# Altium schematic sheet main.SchDoc
size A3
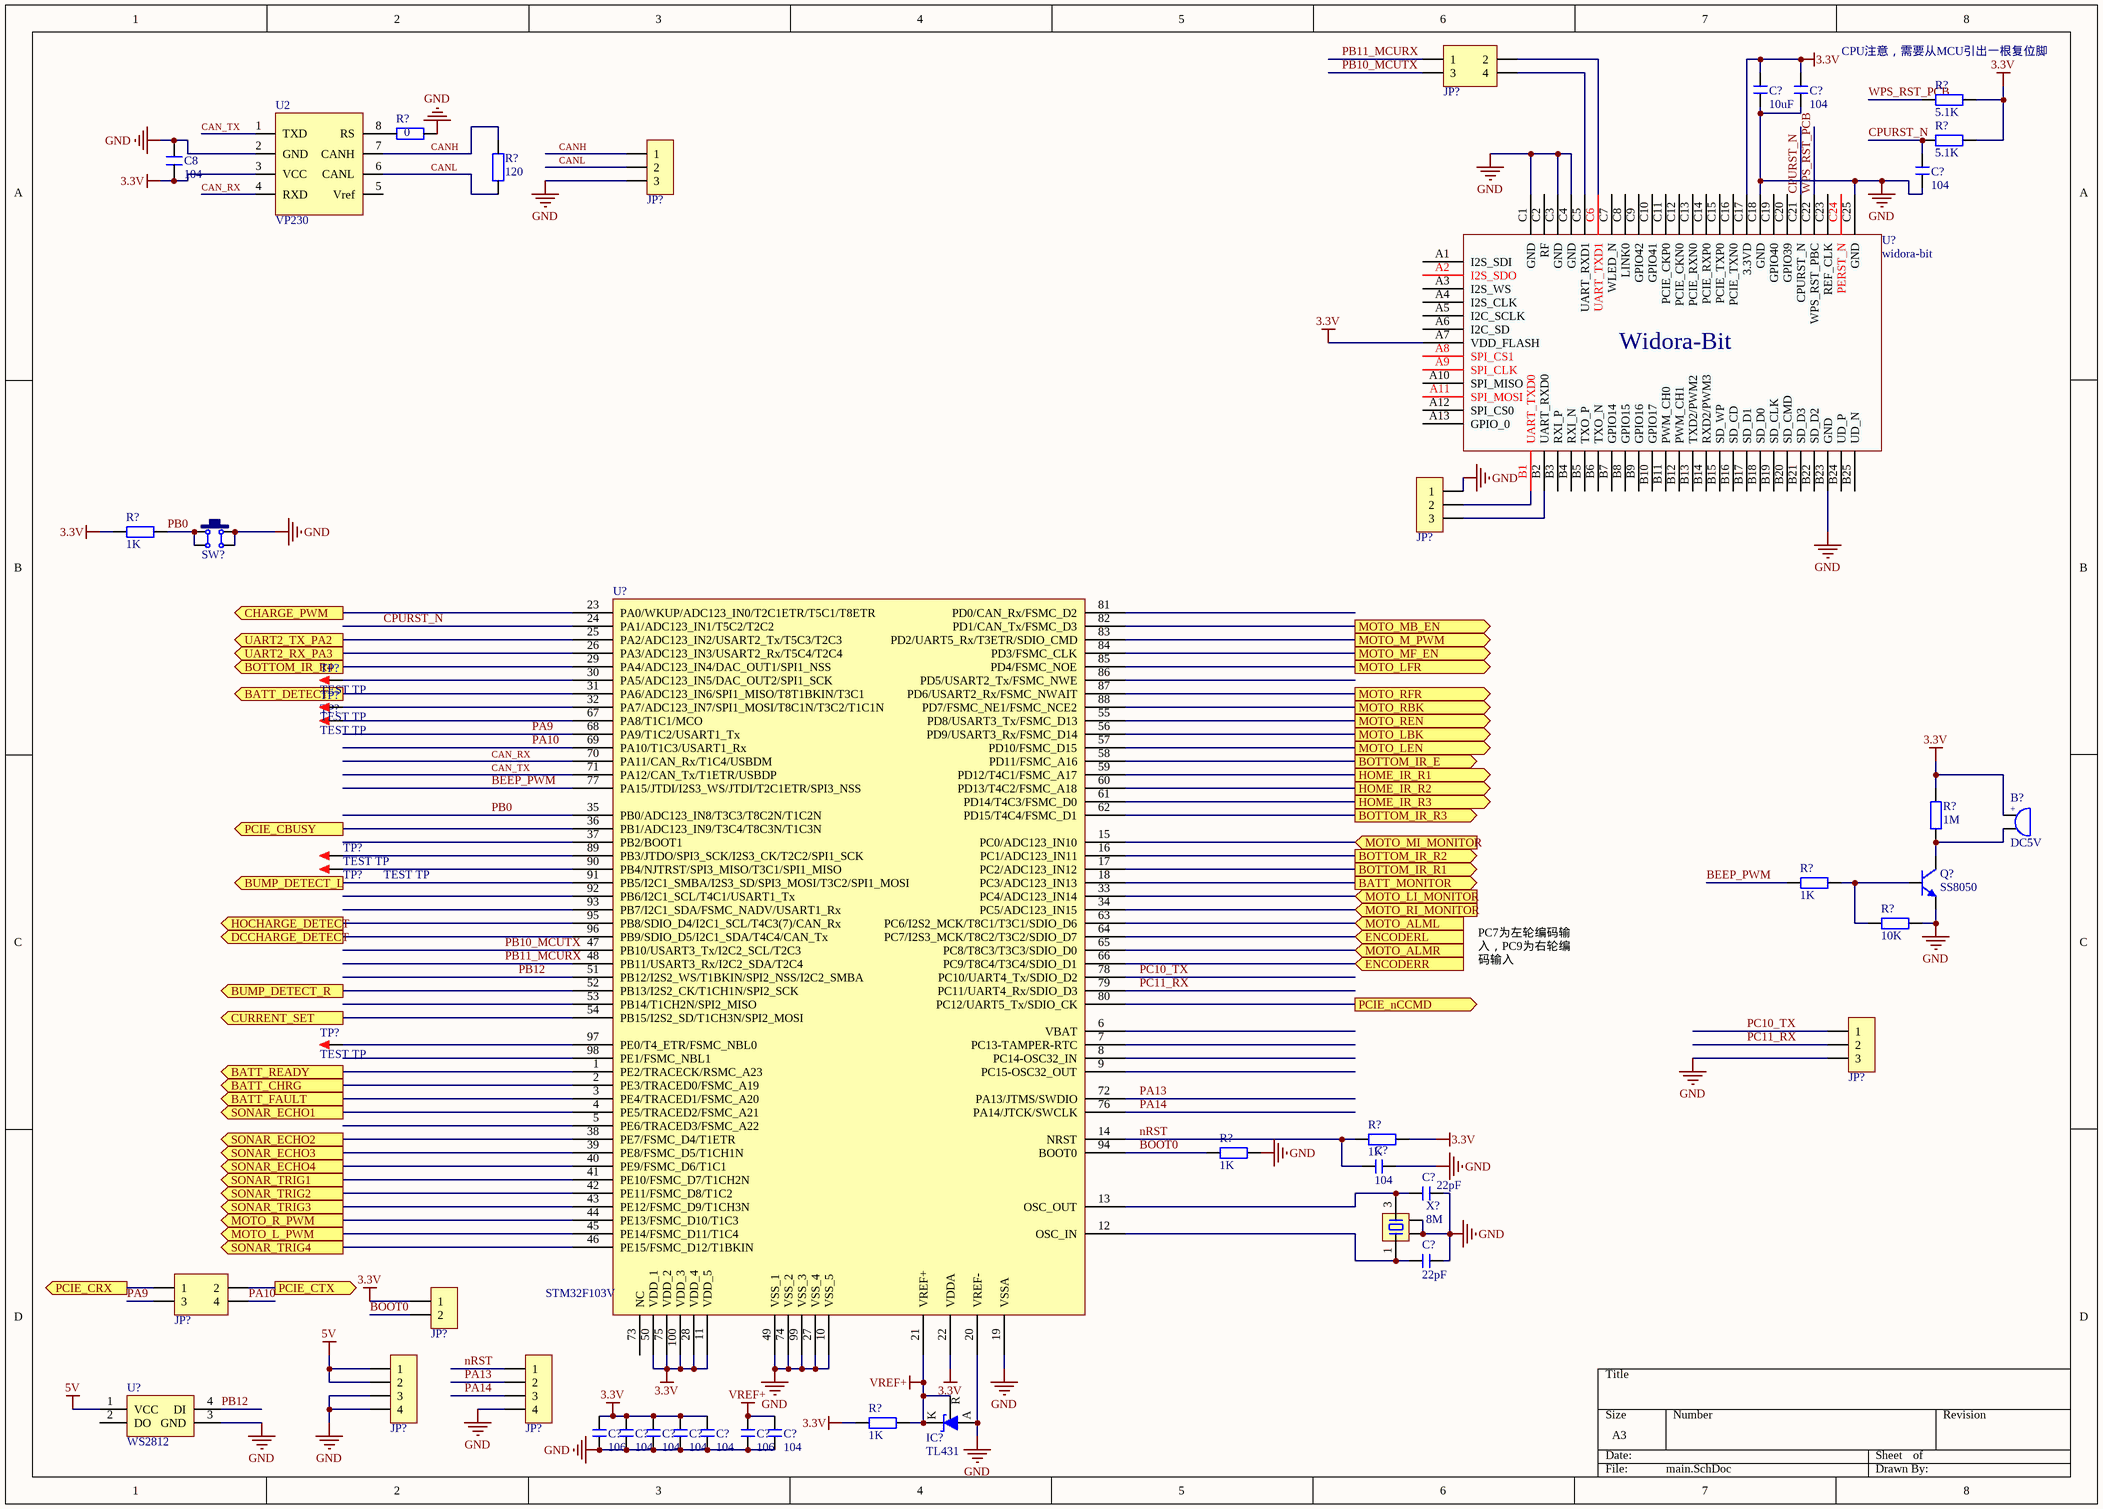
[diagram p0: main.SchDoc]

## Parts
(Parts that share a designator on the sheet are numbered #1, #2 ... from top to bottom, then left to right.)
B?  DC5V  [BEEP 6.5x12x8.5]
C8  104  [C 0603_L]
C?#1  10uF  [C 0805_L]
C?#2  104  [C 0603_L]
C?#3  104  [C 0603_L]
C?#4  104  [C 0603_L]
C?#5  22pF  [C 0603_L]
C?#6  22pF  [C 0603_L]
C?#7  106  [C 0603_L]
C?#8  104  [C 0603_L]
C?#9  104  [C 0603_L]
C?#10  104  [C 0603_L]
C?#11  104  [C 0603_L]
C?#12  106  [C 0603_L]
C?#13  104  [C 0603_L]
IC?  TL431  [SOT23-3N]
JP?#1  Header2X2  [HDR2.54-LI-2x2P]  (value not drawn)
JP?#2  HDR-1X3  [XH2.54-LI-3P]  (value not drawn)
JP?#3  HDR-1X3  [XH2.54-LI-3P]  (value not drawn)
JP?#4  HDR-1X3  [XH2.54-LI-3P]  (value not drawn)
JP?#5  Header2X2  [HDR2.54-LI-2x2P]  (value not drawn)
JP?#6  HDR-1X2  [HDR2.54-LI-2P]  (value not drawn)
JP?#7  HDR-1X4  [HDR-1X4]  (value not drawn)
JP?#8  HDR-1X4  [XH2.54-LI-4P]  (value not drawn)
Q?  SS8050  [SOT23-3N]
R?#1  5.1K  [R 0603_L]
R?#2  0  [R 0603_L]
R?#3  5.1K  [R 0603_L]
R?#4  120  [R 0603_L]
R?#5  1K  [R 0603_L]
R?#6  1M  [R 0603_L]
R?#7  1K  [R 0603_L]
R?#8  10K  [R 0603_L]
R?#9  1K  [R 0603_L]
R?#10  1K  [R 0603_L]
R?#11  1K  [R 0603_L]
SW?  6x6x5  [TSW DIP-6*6*6]  (value not drawn)
TP?#1  TEST TP  [TEST TP1.4_BK]
TP?#2  TEST TP  [TEST TP1.4_BK]
TP?#3  TEST TP  [TEST TP1.4_BK]
TP?#4  TEST TP  [TEST TP1.4_BK]
TP?#5  TEST TP  [TEST TP1.4_BK]
TP?#6  TEST TP  [TEST TP1.4_BK]
U2  VP230  [SOP8_N]
U?#1  widora-bit  [Widora-BIT2]
U?#2  STM32F103V  [LQFP100 14X14_N]
U?#3  WS2812  [WS2812]
X?  8M  [OSC 3225-4P]

## Ports
BATT_CHRG (out), BATT_DETECT (out), BATT_FAULT (out), BATT_MONITOR (out), BATT_READY (out), BOTTOM_IR_E (out), BOTTOM_IR_R1 (out), BOTTOM_IR_R2 (out), BOTTOM_IR_R3 (out), BOTTOM_IR_R4 (out), BUMP_DETECT_L (out), BUMP_DETECT_R (out), CHARGE_PWM (out), CURRENT_SET (out), DCCHARGE_DETECT (out), ENCODERL (in), ENCODERR (in), HOCHARGE_DETECT (out), HOME_IR_R1 (out), HOME_IR_R2 (out), HOME_IR_R3 (out), MOTO_ALML (in), MOTO_ALMR (in), MOTO_L_PWM (out), MOTO_LBK (out), MOTO_LEN (out), MOTO_LFR (out), MOTO_LI_MONITOR (in), MOTO_M_PWM (out), MOTO_MB_EN (out), MOTO_MF_EN (out), MOTO_MI_MONITOR (in), MOTO_R_PWM (out), MOTO_RBK (out), MOTO_REN (out), MOTO_RFR (out), MOTO_RI_MONITOR (in), PCIE_CBUSY (out), PCIE_CRX (out), PCIE_CTX (out), PCIE_nCCMD (out), SONAR_ECHO1 (out), SONAR_ECHO2 (out), SONAR_ECHO3 (out), SONAR_ECHO4 (out), SONAR_TRIG1 (out), SONAR_TRIG2 (out), SONAR_TRIG3 (out), SONAR_TRIG4 (out), UART2_RX_PA3 (out), UART2_TX_PA2 (out)

## Nets
3.3V: B?.1 C8.1 C?#1.2 C?#2.2 C?#7.2 C?#8.2 C?#9.2 C?#10.2 C?#11.2 JP?#6.1 R?#1.1 R?#3.1 R?#5.2 R?#6.2 R?#9.1 R?#11.2 U2.3(VCC) U?#1.A7(VDD_FLASH) U?#1.C17(3.3VD) U?#2.11(VDD_5) U?#2.22(VDDA) U?#2.28(VDD_4) U?#2.50(VDD_1) U?#2.75(VDD_2) U?#2.100(VDD_3)
5V: JP?#7.1 JP?#7.2 U?#3.1(VCC)
GND: C8.2 C?#1.1 C?#2.1 C?#3.1 C?#4.1 C?#5.1 C?#6.1 C?#7.1 C?#8.1 C?#9.1 C?#10.1 C?#11.1 C?#12.1 C?#13.1 IC?.3(A) JP?#2.3 JP?#3.1 JP?#4.3 JP?#7.3 JP?#7.4 JP?#8.4 Q?.2(E) R?#2.2 R?#8.1 R?#10.1 SW?.2 SW?.3 U2.2(GND) U?#1.B23(GND) U?#1.C1(GND) U?#1.C3(GND) U?#1.C4(GND) U?#1.C18(GND) U?#1.C25(GND) U?#2.10(VSS_5) U?#2.19(VSSA) U?#2.20(VREF-) U?#2.27(VSS_4) U?#2.49(VSS_1) U?#2.74(VSS_2) U?#2.99(VSS_3) U?#3.3(GND) X?.2 X?.4
VREF+: C?#12.2 C?#13.2 IC?.1(R) IC?.2(K) R?#11.1 U?#2.21(VREF+)
BATT_CHRG: U?#2.2(PE3/TRACED0/FSMC_A19) ; port BATT_CHRG
BATT_DETECT: U?#2.31(PA6/ADC123_IN6/SPI1_MISO/T8T1BKIN/T3C1) ; port BATT_DETECT
BATT_FAULT: U?#2.3(PE4/TRACED1/FSMC_A20) ; port BATT_FAULT
BATT_MONITOR: U?#2.18(PC3/ADC123_IN13) ; port BATT_MONITOR
BATT_READY: U?#2.1(PE2/TRACECK/RSMC_A23) ; port BATT_READY
BEEP_PWM: R?#7.2 U?#2.77(PA15/JTDI/I2S3_WS/JTDI/T2C1ETR/SPI3_NSS)
BOOT0: JP?#6.2 R?#10.2 U?#2.94(BOOT0)
BOTTOM_IR_E: U?#2.58(PD11/FSMC_A16) ; port BOTTOM_IR_E
BOTTOM_IR_R1: U?#2.17(PC2/ADC123_IN12) ; port BOTTOM_IR_R1
BOTTOM_IR_R2: U?#2.16(PC1/ADC123_IN11) ; port BOTTOM_IR_R2
BOTTOM_IR_R3: U?#2.62(PD15/T4C4/FSMC_D1) ; port BOTTOM_IR_R3
BOTTOM_IR_R4: U?#2.29(PA4/ADC123_IN4/DAC_OUT1/SPI1_NSS) ; port BOTTOM_IR_R4
BUMP_DETECT_L: U?#2.91(PB5/I2C1_SMBA/I2S3_SD/SPI3_MOSI/T3C2/SPI1_MOSI) ; port BUMP_DETECT_L
BUMP_DETECT_R: U?#2.52(PB13/I2S2_CK/T1CH1N/SPI2_SCK) ; port BUMP_DETECT_R
CAN_RX: U2.4(RXD) U?#2.70(PA11/CAN_Rx/T1C4/USBDM)
CAN_TX: U2.1(TXD) U?#2.71(PA12/CAN_Tx/T1ETR/USBDP)
CANH: JP?#2.1 R?#4.2 U2.7(CANH)
CANL: JP?#2.2 R?#4.1 U2.6(CANL)
CHARGE_PWM: U?#2.23(PA0/WKUP/ADC123_IN0/T2C1ETR/T5C1/T8ETR) ; port CHARGE_PWM
CPURST_N: C?#3.2 R?#3.2 U?#1.C21(CPURST_N) U?#2.24(PA1/ADC123_IN1/T5C2/T2C2)
CURRENT_SET: U?#2.54(PB15/I2S2_SD/T1CH3N/SPI2_MOSI) ; port CURRENT_SET
DCCHARGE_DETECT: U?#2.96(PB9/SDIO_D5/I2C1_SDA/T4C4/CAN_Tx) ; port DCCHARGE_DETECT
ENCODERL: U?#2.64(PC7/I2S3_MCK/T8C2/T3C2/SDIO_D7) ; port ENCODERL
ENCODERR: U?#2.66(PC9/T8C4/T3C4/SDIO_D1) ; port ENCODERR
HOCHARGE_DETECT: U?#2.95(PB8/SDIO_D4/I2C1_SCL/T4C3(7)/CAN_Rx) ; port HOCHARGE_DETECT
HOME_IR_R1: U?#2.59(PD12/T4C1/FSMC_A17) ; port HOME_IR_R1
HOME_IR_R2: U?#2.60(PD13/T4C2/FSMC_A18) ; port HOME_IR_R2
HOME_IR_R3: U?#2.61(PD14/T4C3/FSMC_D0) ; port HOME_IR_R3
MOTO_ALML: U?#2.63(PC6/I2S2_MCK/T8C1/T3C1/SDIO_D6) ; port MOTO_ALML
MOTO_ALMR: U?#2.65(PC8/T8C3/T3C3/SDIO_D0) ; port MOTO_ALMR
MOTO_L_PWM: U?#2.45(PE14/FSMC_D11/T1C4) ; port MOTO_L_PWM
MOTO_LBK: U?#2.56(PD9/USART3_Rx/FSMC_D14) ; port MOTO_LBK
MOTO_LEN: U?#2.57(PD10/FSMC_D15) ; port MOTO_LEN
MOTO_LFR: U?#2.85(PD4/FSMC_NOE) ; port MOTO_LFR
MOTO_LI_MONITOR: U?#2.33(PC4/ADC123_IN14) ; port MOTO_LI_MONITOR
MOTO_M_PWM: U?#2.83(PD2/UART5_Rx/T3ETR/SDIO_CMD) ; port MOTO_M_PWM
MOTO_MB_EN: U?#2.82(PD1/CAN_Tx/FSMC_D3) ; port MOTO_MB_EN
MOTO_MF_EN: U?#2.84(PD3/FSMC_CLK) ; port MOTO_MF_EN
MOTO_MI_MONITOR: U?#2.15(PC0/ADC123_IN10) ; port MOTO_MI_MONITOR
MOTO_R_PWM: U?#2.44(PE13/FSMC_D10/T1C3) ; port MOTO_R_PWM
MOTO_RBK: U?#2.88(PD7/FSMC_NE1/FSMC_NCE2) ; port MOTO_RBK
MOTO_REN: U?#2.55(PD8/USART3_Tx/FSMC_D13) ; port MOTO_REN
MOTO_RFR: U?#2.87(PD6/USART2_Rx/FSMC_NWAIT) ; port MOTO_RFR
MOTO_RI_MONITOR: U?#2.34(PC5/ADC123_IN15) ; port MOTO_RI_MONITOR
nRST: C?#4.2 JP?#8.1 R?#9.2 U?#2.14(NRST)
PA9: JP?#5.3 U?#2.68(PA9/T1C2/USART1_Tx)
PA10: JP?#5.4 U?#2.69(PA10/T1C3/USART1_Rx)
PA13: JP?#8.2 U?#2.72(PA13/JTMS/SWDIO)
PA14: JP?#8.3 U?#2.76(PA14/JTCK/SWCLK)
PB0: R?#5.1 SW?.1 SW?.4 U?#2.35(PB0/ADC123_IN8/T3C3/T8C2N/T1C2N)
PB10_MCUTX: JP?#1.3 U?#2.47(PB10/USART3_Tx/I2C2_SCL/T2C3)
PB11_MCURX: JP?#1.1 U?#2.48(PB11/USART3_Rx/I2C2_SDA/T2C4)
PB12: U?#2.51(PB12/I2S2_WS/T1BKIN/SPI2_NSS/I2C2_SMBA) U?#3.4(DI)
PC10_TX: JP?#4.1 U?#2.78(PC10/UART4_Tx/SDIO_D2)
PC11_RX: JP?#4.2 U?#2.79(PC11/UART4_Rx/SDIO_D3)
PCIE_CBUSY: U?#2.36(PB1/ADC123_IN9/T3C4/T8C3N/T1C3N) ; port PCIE_CBUSY
PCIE_CRX: JP?#5.1 ; port PCIE_CRX
PCIE_CTX: JP?#5.2 ; port PCIE_CTX
PCIE_nCCMD: U?#2.80(PC12/UART5_Tx/SDIO_CK) ; port PCIE_nCCMD
SONAR_ECHO1: U?#2.4(PE5/TRACED2/FSMC_A21) ; port SONAR_ECHO1
SONAR_ECHO2: U?#2.38(PE7/FSMC_D4/T1ETR) ; port SONAR_ECHO2
SONAR_ECHO3: U?#2.39(PE8/FSMC_D5/T1CH1N) ; port SONAR_ECHO3
SONAR_ECHO4: U?#2.40(PE9/FSMC_D6/T1C1) ; port SONAR_ECHO4
SONAR_TRIG1: U?#2.41(PE10/FSMC_D7/T1CH2N) ; port SONAR_TRIG1
SONAR_TRIG2: U?#2.42(PE11/FSMC_D8/T1C2) ; port SONAR_TRIG2
SONAR_TRIG3: U?#2.43(PE12/FSMC_D9/T1CH3N) ; port SONAR_TRIG3
SONAR_TRIG4: U?#2.46(PE15/FSMC_D12/T1BKIN) ; port SONAR_TRIG4
UART2_RX_PA3: U?#2.26(PA3/ADC123_IN3/USART2_Rx/T5C4/T2C4) ; port UART2_RX_PA3
UART2_TX_PA2: U?#2.25(PA2/ADC123_IN2/USART2_Tx/T5C3/T2C3) ; port UART2_TX_PA2
WPS_RST_PCB: R?#1.2 U?#1.C22(WPS_RST_PBC)
NetB?_2: B?.2 Q?.3(C) R?#6.1
NetC?#5_2: C?#5.2 U?#2.13(OSC_OUT) X?.3
NetC?#6_2: C?#6.2 U?#2.12(OSC_IN) X?.1
NetJP?#1_2: JP?#1.2 U?#1.C6(UART_TXD1)
NetJP?#1_4: JP?#1.4 U?#1.C5(UART_RXD1)
NetJP?#3_2: JP?#3.2 U?#1.B1(UART_TXD0)
NetJP?#3_3: JP?#3.3 U?#1.B2(UART_RXD0)
NetQ?_1: Q?.1(B) R?#7.1 R?#8.2
NetR?#2_1: R?#2.1 U2.8(RS)
NetTP?#1_1: TP?#1.1 U?#2.30(PA5/ADC123_IN5/DAC_OUT2/SPI1_SCK)
NetTP?#2_1: TP?#2.1 U?#2.32(PA7/ADC123_IN7/SPI1_MOSI/T8C1N/T3C2/T1C1N)
NetTP?#3_1: TP?#3.1 U?#2.67(PA8/T1C1/MCO)
NetTP?#4_1: TP?#4.1 U?#2.89(PB3/JTDO/SPI3_SCK/I2S3_CK/T2C2/SPI1_SCK)
NetTP?#5_1: TP?#5.1 U?#2.90(PB4/NJTRST/SPI3_MISO/T3C1/SPI1_MISO)
NetTP?#6_1: TP?#6.1 U?#2.97(PE0/T4_ETR/FSMC_NBL0)

Not connected (* = marked no-connect by the designer): U2 5(Vref); U?#1 A1(I2S_SDI) A2(I2S_SDO) A3(I2S_WS) A4(I2S_CLK) A5(I2C_SCLK) A6(I2C_SD) A8(SPI_CS1) A9(SPI_CLK) A10(SPI_MISO) A11(SPI_MOSI) A12(SPI_CS0) A13(GPIO_0) B3(RXI_P) B4(RXI_N) B5(TXO_P) B6(TXO_N) B7(GPIO14) B8(GPIO15) B9(GPIO16) B10(GPIO17) B11(PWM_CH0) B12(PWM_CH1) B13(TXD2/PWM2) B14(RXD2/PWM3) B15(SD_WP) B16(SD_CD) B17(SD_D1) B18(SD_D0) B19(SD_CLK) B20(SD_CMD) B21(SD_D3) B22(SD_D2) B24(UD_P) B25(UD_N) C2(RF) C7(WLED_N) C8(LINK0) C9(GPIO42) C10(GPIO41) C11(PCIE_CKP0) C12(PCIE_CKN0) C13(PCIE_RXN0) C14(PCIE_RXP0) C15(PCIE_TXP0) C16(PCIE_TXN0) C19(GPIO40) C20(GPIO39) C23(REF_CLK) C24(PERST_N); U?#2 5(PE6/TRACED3/FSMC_A22) 6(VBAT) 7(PC13-TAMPER-RTC) 8(PC14-OSC32_IN) 9(PC15-OSC32_OUT) 37(PB2/BOOT1) 53(PB14/T1CH2N/SPI2_MISO) 73(NC) 81(PD0/CAN_Rx/FSMC_D2) 86(PD5/USART2_Tx/FSMC_NWE) 92(PB6/I2C1_SCL/T4C1/USART1_Tx) 93(PB7/I2C1_SDA/FSMC_NADV/USART1_Rx) 98(PE1/FSMC_NBL1); U?#3 2(DO)

## Notes on the sheet
- CPU注意，需要从MCU引出一根复位脚
- PC7为左轮编码输入，PC9为右轮编码输入
- (in symbol BEEP) +
- (in symbol widora-bit) Widora-Bit

## Library data of the parts
B? = BEEP: 蜂鸣器; 版权归属: 源创客; BOM名称: 蜂鸣器; 学习资源: www.ooocke.com
C8 = CAP_SMT_0603
C?#1-C?#13 = C: 无极性贴片电容; 版权归属: 源创客; BOM名称: 无极性贴片电容; 学习资源: www.ooocke.com
IC? = TL431_SMD: 可调基准稳压芯片; 版权归属: 源创客; BOM名称: 可调基准稳压芯片; 学习资源: www.ooocke.com
JP?#1 JP?#5 = Header 2X2: 2*2P接插件; 版权归属: 源创客; BOM名称: 2*2P接插件; 学习资源: www.ooocke.com
JP?#2-JP?#4 = Header 3: 3P接插件; 版权归属: 源创客; BOM名称: 3P接插件; 学习资源: www.ooocke.com
JP?#6 = Header 2: 2P接插件; 版权归属: 源创客; BOM名称: 2P接插件; 学习资源: www.ooocke.com
JP?#7 JP?#8 = Header 4: 4P接插件; 版权归属: 源创客; BOM名称: 4P接插件; 学习资源: www.ooocke.com
Q? = 8050-SMD: 高频放大-NPN型; 版权归属: 源创客; 属性: 40V 1.5A 1W 100MHZ; BOM名称: 高频放大-NPN型; 学习资源: www.ooocke.com
R?#1 R?#3 R?#5-R?#11 = R: 贴片电阻; 版权归属: 源创客; BOM名称: 贴片电阻; 学习资源: www.ooocke.com
R?#2 R?#4 = RES_SMT_0603
SW? = TSW DIP-6x6: 直插6x6轻触开关; 版权归属: 源创客; BOM名称: 直插6x6轻触开关; 学习资源: www.ooocke.com
TP?#1-TP?#6 = TEST TP: 测试环; 版权归属: 源创客; BOM名称: 测试环; 学习资源: www.ooocke.com
U?#2 = STM32F103V: 32位STM单片机100引脚; 版权归属: 源创客; BOM名称: 32位STM单片机100引脚; 学习资源: www.ooocke.com
U?#3 = WS2812: 集成LED灯
X? = XTAL-4P: 4脚无源晶振; 版权归属: 源创客; BOM名称: 4脚无源晶振; 学习资源: www.ooocke.com